# EAGLE design board (EAGLE 9.6.2)
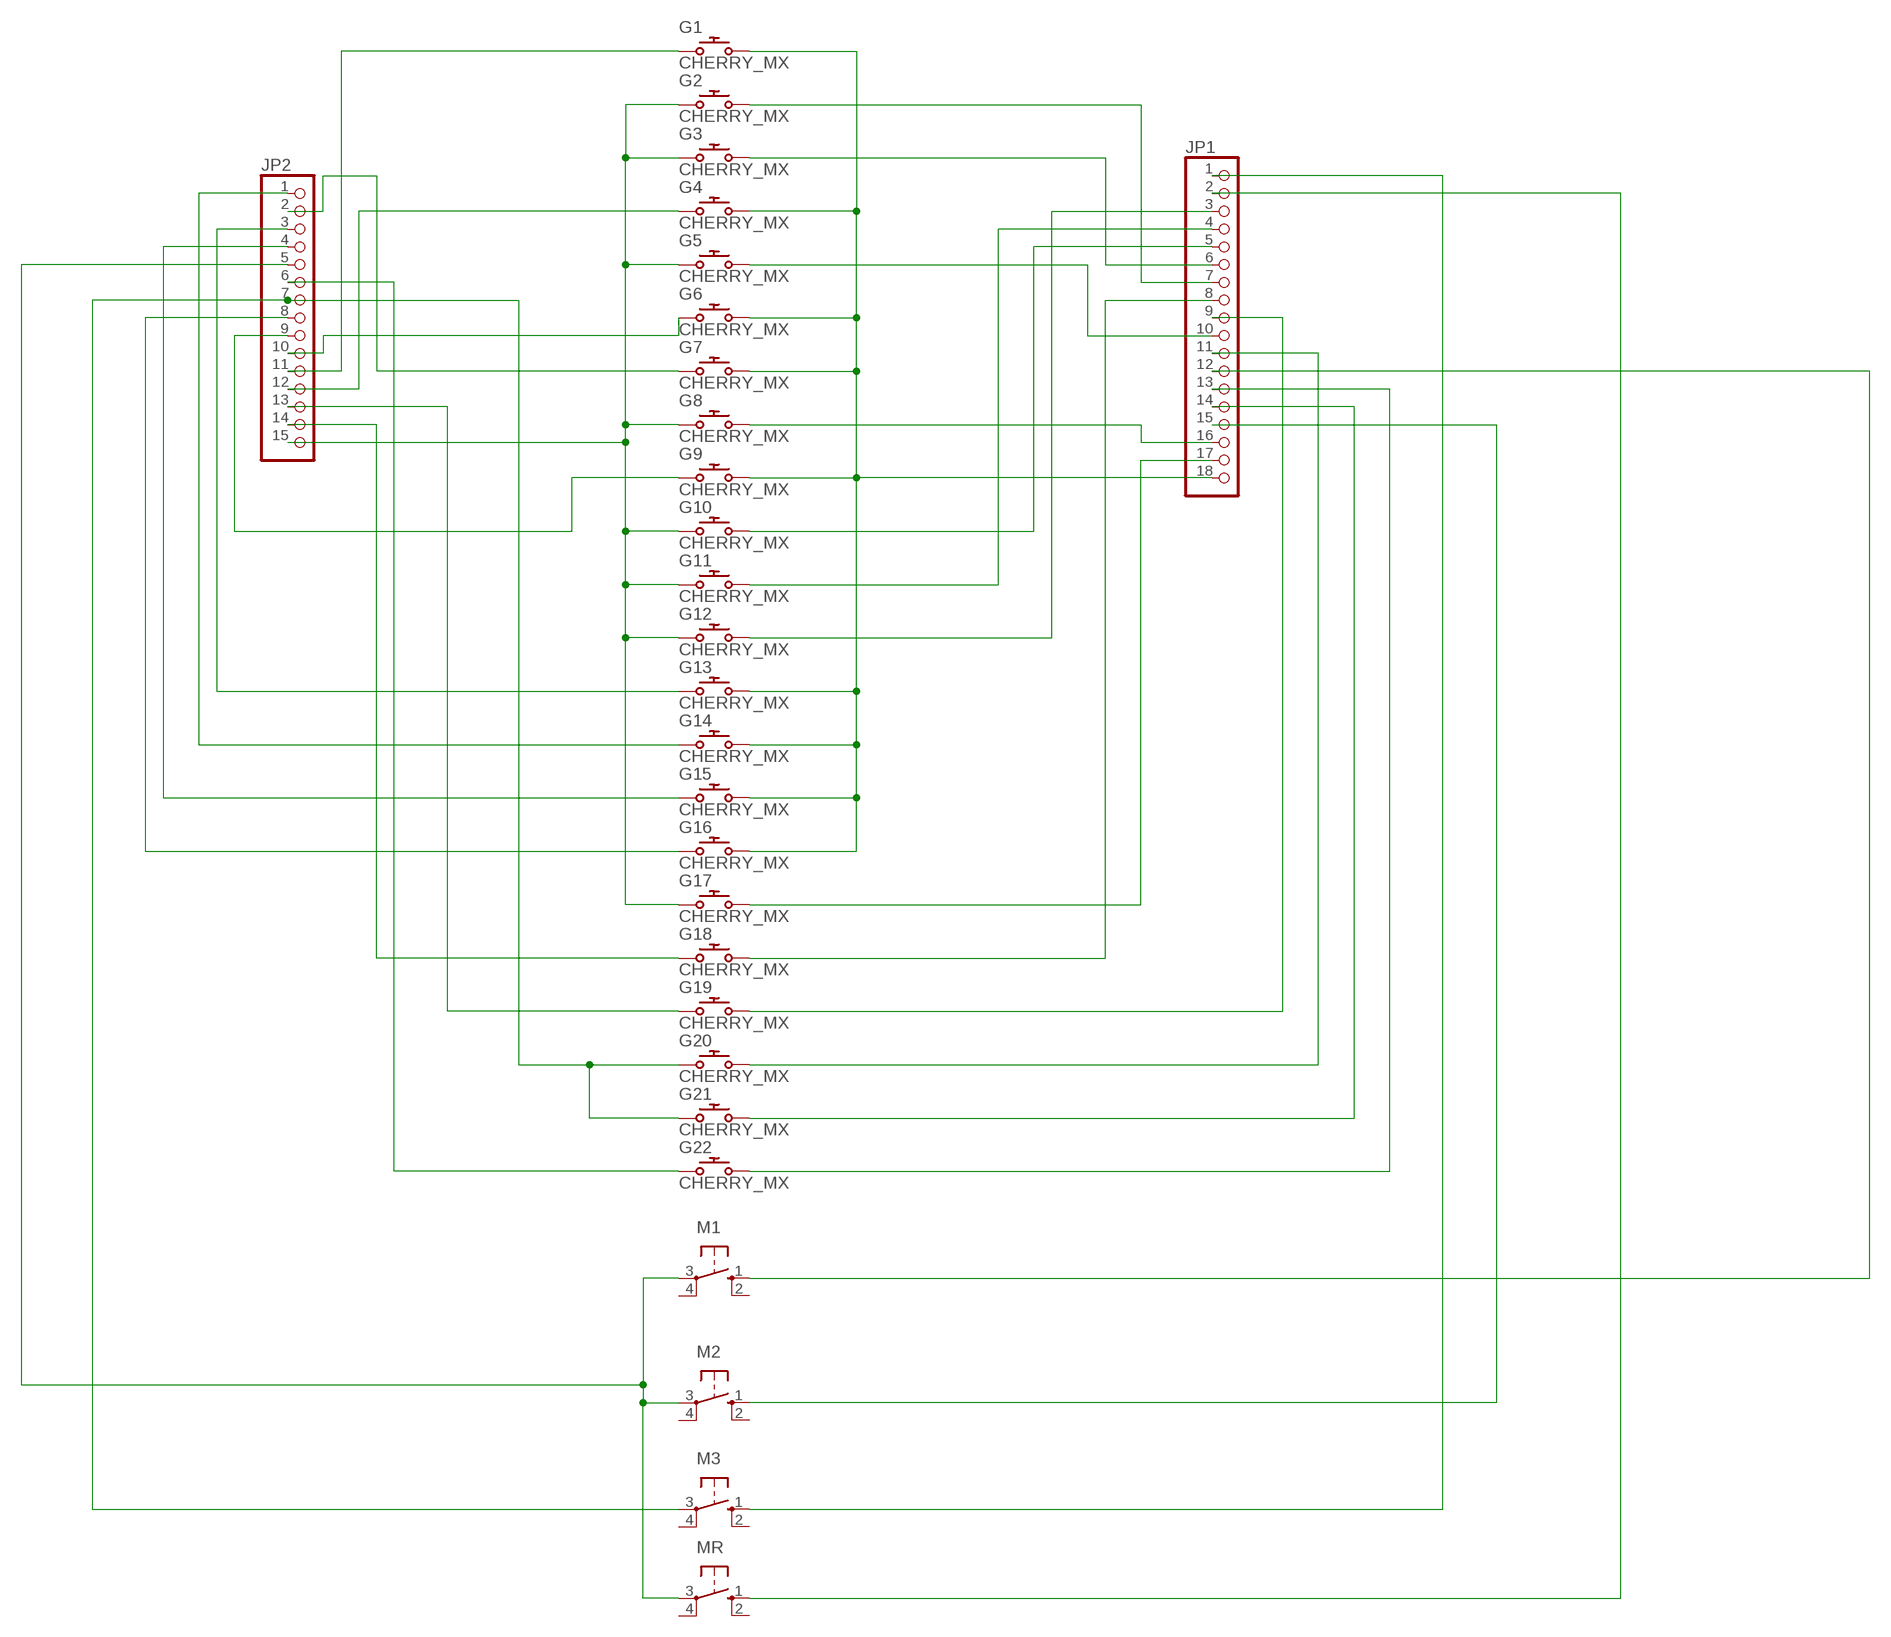
[diagram p0: schematic, sheet 1]

## Parts
G1  CHERRY_MX  [CHERRY_MX]
G2  CHERRY_MX  [CHERRY_MX]
G3  CHERRY_MX  [CHERRY_MX]
G4  CHERRY_MX  [CHERRY_MX]
G5  CHERRY_MX  [CHERRY_MX]
G6  CHERRY_MX  [CHERRY_MX]
G7  CHERRY_MX  [CHERRY_MX]
G8  CHERRY_MX  [CHERRY_MX]
G9  CHERRY_MX  [CHERRY_MX]
G10  CHERRY_MX  [CHERRY_MX]
G11  CHERRY_MX  [CHERRY_MX]
G12  CHERRY_MX  [CHERRY_MX]
G13  CHERRY_MX  [CHERRY_MX]
G14  CHERRY_MX  [CHERRY_MX]
G15  CHERRY_MX  [CHERRY_MX]
G16  CHERRY_MX  [CHERRY_MX]
G17  CHERRY_MX  [CHERRY_MX]
G18  CHERRY_MX  [CHERRY_MX]
G19  CHERRY_MX  [CHERRY_MX]
G20  CHERRY_MX  [CHERRY_MX]
G21  CHERRY_MX  [CHERRY_MX]
G22  CHERRY_MX  [CHERRY_MX]
JP1  PINHD-1X18/90  [1X18/90]
JP2  PINHD-1X15/90  [1X15/90]
M1  10-XX  [B3F-10XX]
M2  10-XX  [B3F-10XX]
M3  10-XX  [B3F-10XX]
MR  10-XX  [B3F-10XX]

## Nets
N$1: G2.S1 G3.S1 G5.S1 G8.S1 G10.S1 G11.S1 G12.S1 G17.S1 JP2.15
N$2: G6.S1 JP2.10
N$3: G1.S1 JP2.11
N$4: G4.S1 JP2.12
N$5: G7.S1 JP2.2
N$6: G13.S1 JP2.3
N$7: G9.S1 JP2.9
N$8: G14.S1 JP2.1
N$9: G15.S1 JP2.4
N$10: G16.S1 JP2.8
N$11: G18.S1 JP2.14
N$12: G19.S1 JP2.13
N$13: G20.S1 G21.S1 JP2.7 M3.3(P)
N$14: G11.S2 JP1.4
N$15: G22.S1 JP2.6
N$16: G1.S2 G4.S2 G6.S2 G7.S2 G9.S2 G13.S2 G14.S2 G15.S2 G16.S2 JP1.18
N$17: G2.S2 JP1.7
N$18: G3.S2 JP1.6
N$19: G5.S2 JP1.10
N$20: G8.S2 JP1.16
N$21: G10.S2 JP1.5
N$22: G12.S2 JP1.3
N$23: G17.S2 JP1.17
N$24: G18.S2 JP1.8
N$25: G19.S2 JP1.9
N$26: G20.S2 JP1.11
N$27: G21.S2 JP1.14
N$28: G22.S2 JP1.13
N$29: JP2.5 M1.3(P) M2.3(P) MR.3(P)
N$31: JP1.1 M3.1(S)
N$32: JP1.2 MR.1(S)
N$33: JP1.15 M2.1(S)
N$34: JP1.12 M1.1(S)
Unconnected: M1.2(S1) M1.4(P1) M2.2(S1) M2.4(P1) M3.2(S1) M3.4(P1) MR.2(S1) MR.4(P1)

## Library data of the parts
G1-G22 = cherry:CHERRY_MX: Cherry keymodule MX; FARNELL: 2292961; MOUSER: 540-MX1A-11NW
JP1 = pinhead:PINHD-1X18: PIN HEADER
JP2 = pinhead:PINHD-1X15: PIN HEADER
M1-M3 MR = switch-omron:10-XX: OMRON SWITCH; MPN: B3F-1000; OC_FARNELL: 176432; OC_NEWARK: 36M3542

## Board
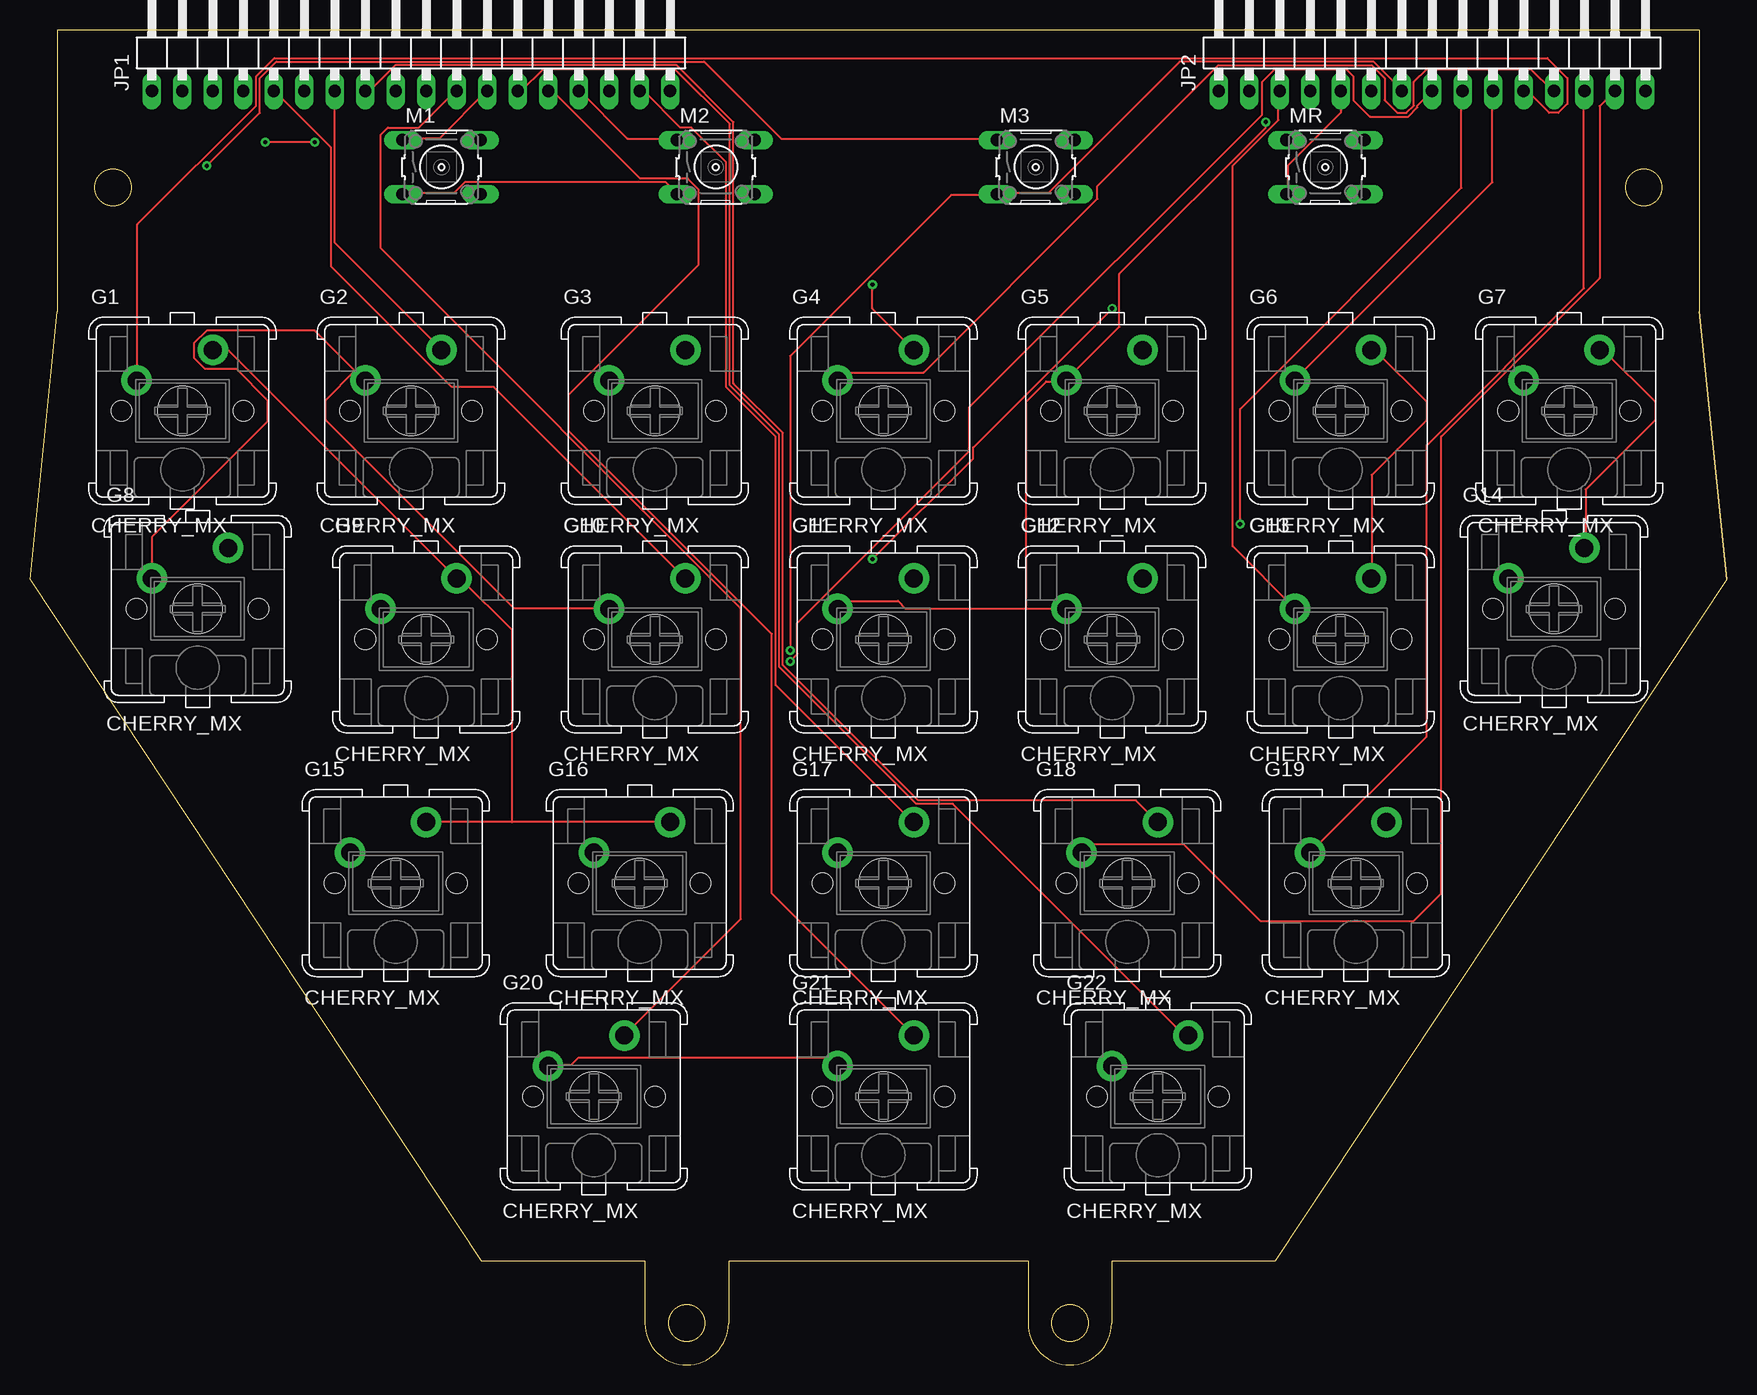
[diagram p1: board, top side]
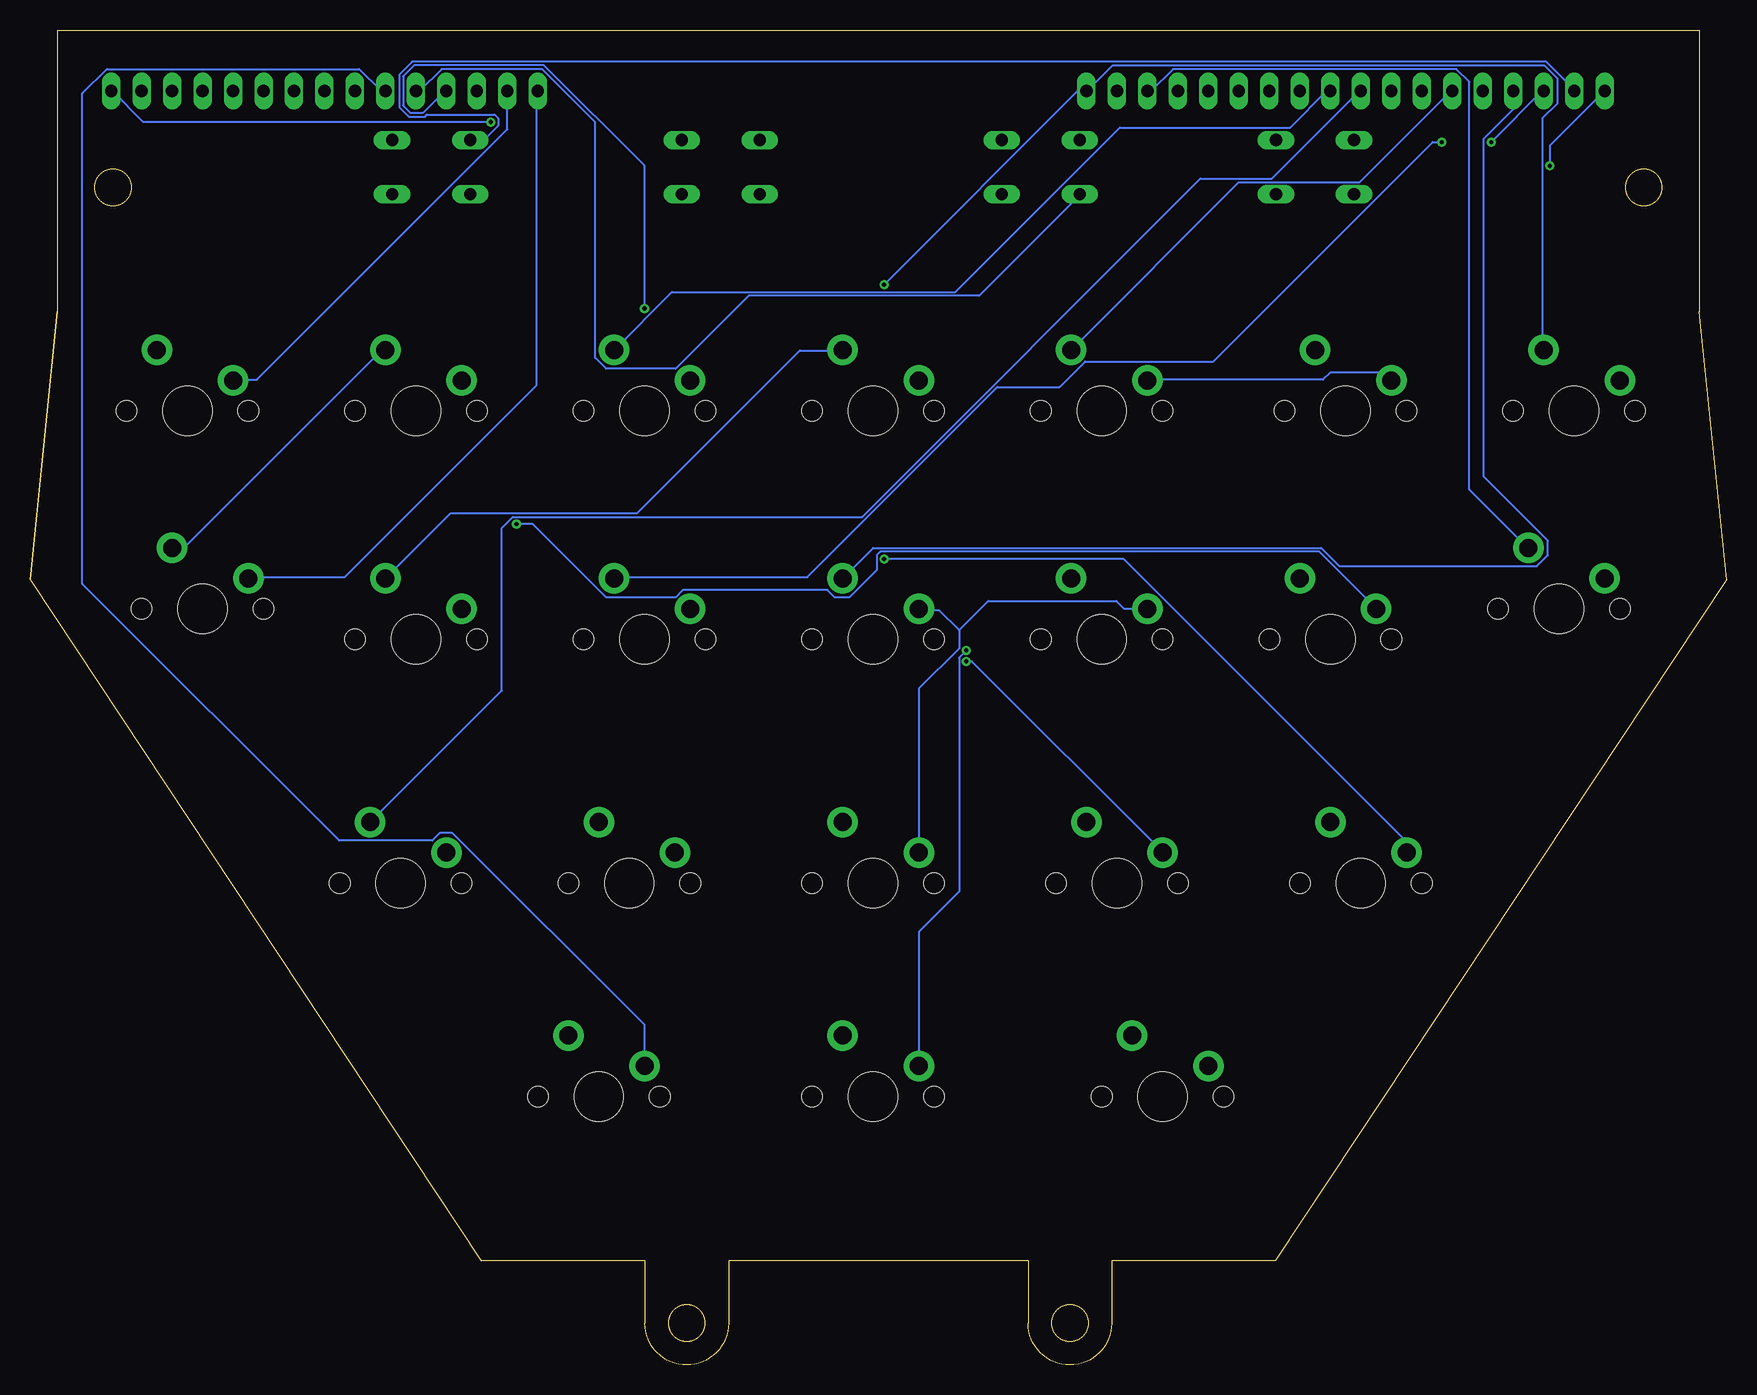
[diagram p2: board, bottom side, seen from below]

Size 141.38 x 111.29 mm. Coordinates in mm from the lower left corner, seen from the top.
Outline: 139.1,87.83 141.38,65.48 103.78,8.67 90.14,8.67 90.14,3.49 arc-180 83.17,3.49 83.17,8.67 58.21,8.67 58.21,3.49 arc-180 51.24,3.49 51.24,8.67 37.6,8.67 0,65.48 2.28,87.83 2.28,111.29 139.1,111.29 139.1,87.83
Outline: 139.1,87.83 141.38,65.5
Outline: circle at 134.48,98.16 radius 1.52
Outline: circle at 6.9,98.16 radius 1.52
Outline: circle at 54.73,3.49 radius 1.52
Outline: circle at 86.65,3.49 radius 1.52
Copper layers (1*16): Top 0.035mm / dielectric 1.5mm / Bottom 0.035mm
Design rules "default": minimum track width 6mil, minimum drill 0.35mm, track to track 6mil, track to pad 6mil, pad to pad 6mil, via to via 6mil, smd to smd 6mil, copper to edge 40mil, drill to drill 6mil, minimum pad ring 10mil, minimum via ring 8mil, stop-mask expansion 4mil, vias tented up to drill 0mil, thermal gap 10mil

### Footprints (pad centres in the part's own frame; a part is rotated, then mirrored left to right if it is on the bottom)
CHERRY_MX = drill 1.5 pad 2.54: S1 -3.81,2.54; S2 2.54,5.08 | hole 1.7: -5.08,0; 5.08,0 | hole 4.1: 0,0
1X18/90 = drill 1.016 long: 1 -21.59,-3.81; 2 -19.05,-3.81; 3 -16.51,-3.81; 4 -13.97,-3.81; 5 -11.43,-3.81; 6 -8.89,-3.81; 7 -6.35,-3.81; 8 -3.81,-3.81; 9 -1.27,-3.81; 10 1.27,-3.81; 11 3.81,-3.81; 12 6.35,-3.81; 13 8.89,-3.81; 14 11.43,-3.81; 15 13.97,-3.81; 16 16.51,-3.81; 17 19.05,-3.81; 18 21.59,-3.81
1X15/90 = drill 1.016 long: 1 -17.78,-3.81; 2 -15.24,-3.81; 3 -12.7,-3.81; 4 -10.16,-3.81; 5 -7.62,-3.81; 6 -5.08,-3.81; 7 -2.54,-3.81; 8 0,-3.81; 9 2.54,-3.81; 10 5.08,-3.81; 11 7.62,-3.81; 12 10.16,-3.81; 13 12.7,-3.81; 14 15.24,-3.81; 15 17.78,-3.81
B3F-10XX = drill 1.016 long: 1 -3.251,2.261; 2 3.251,2.261; 3 -3.251,-2.261; 4 3.251,-2.261

### Placement (x,y rotation side)
G1  12.7,79.54 0 top
G2  31.75,79.54 0 top
G3  52.07,79.54 0 top
G4  71.12,79.54 0 top
G5  90.17,79.54 0 top
G6  109.22,79.54 0 top
G7  128.27,79.54 0 top
G8  13.97,63.03 0 top
G9  33.02,60.49 0 top
G10  52.07,60.49 0 top
G11  71.12,60.49 0 top
G12  90.17,60.49 0 top
G13  109.22,60.49 0 top
G14  127,63.03 0 top
G15  30.48,40.17 0 top
G16  50.8,40.17 0 top
G17  71.12,40.17 0 top
G18  91.44,40.17 0 top
G19  110.49,40.17 0 top
G20  46.99,22.39 0 top
G21  71.12,22.39 0 top
G22  93.98,22.39 0 top
JP1  31.75,110.02 0 top
JP2  116.84,110.02 0 top
M1  34.29,99.86 0 top
M2  57.15,99.86 0 top
M3  83.82,99.86 0 top
MR  107.95,99.86 0 top

### Tracks (layer width: path | path; a pad name or v marks a point on that pad's centre or on a via)
N$1  (via drill 0.35)
  Top 0.152: v102.97,103.62 102.97,103.16 90.78,90.97 90.78,86.55 86.36,82.13 G5.S1 86.36,81.98 84.68,81.98 83.01,80.3 83.01,63.08 | G8.S1 10.16,69.02 19.76,78.63 19.76,80.45 17.17,83.05 14.58,83.05 13.66,83.96 13.66,85.18 14.73,86.25 23.72,86.25 27.08,82.89 | 27.08,82.89 27.84,82.13 G2.S1 27.08,82.89 | 83.01,63.08 72.95,63.08 72.34,63.69 67.92,63.69 67.31,63.08 G11.S1 | 83.01,63.08 86.36,63.08 G12.S1 | 27.08,82.89 24.64,80.45 24.64,78.78 40.34,63.08 48.26,63.08 G10.S1
  Bottom 0.152: v102.97,103.62 131.93,103.62 134.52,106.21 JP2.15 | G2.S1 28.6,82.74 33.02,82.74 33.63,82.13 48.26,82.13 G3.S1 | G17.S1 67.31,56.38 63.96,59.73 63.96,61.25 | 63.96,61.25 65.63,62.93 67.31,62.93 G11.S1 | 63.96,61.25 61.52,63.69 50.85,63.69 50.24,63.08 48.26,63.08 G10.S1
N$2
  Top 0.152: JP2.10 121.87,106.21 121.87,98.59 105.41,82.13 G6.S1
N$3
  Top 0.152: JP2.11 124.77,106.21 126.59,104.38 127.36,104.38 128.12,105.14 128.12,107.28 126.44,108.95 20.37,108.95 18.85,107.43 18.85,104.99 8.94,95.09 8.94,82.13 G1.S1
N$4
  Top 0.152: JP2.12 126.9,106.21 125.07,108.04 116.38,108.04 115.32,106.97 115.32,104.99 114.71,104.38 113.94,104.38 112.88,105.45 112.88,107.28 111.81,108.34 99.01,108.34 88.95,98.29 88.95,97.22 74.47,82.74 67.92,82.74 67.31,82.13 G4.S1
N$5
  Bottom 0.152: JP2.2 101.6,103.01 122.48,82.13 124.46,82.13 G7.S1
N$6
  Top 0.152: JP2.3 104.04,106.21 104.04,103.77 100.23,99.96 100.23,68.26 105.41,63.08 G13.S1
N$7  (via drill 0.35)
  Top 0.152: v100.84,70.09 100.84,79.69 119.28,98.13 119.28,106.21 JP2.9
  Bottom 0.152: v100.84,70.09 99.47,70.09 93.37,64 87.58,64 86.97,64.61 74.93,64.61 74.32,64 73.1,64 70.81,66.28 70.81,67.5 70.51,67.81 33.93,67.81 29.21,63.08 G9.S1
N$8
  Bottom 0.152: JP2.1 99.16,106.21 99.16,81.67 115.16,65.67 123.09,65.67 G14.S1
N$9  (via drill 0.35)
  Top 0.152: v90.17,88.07 78.59,76.49 78.59,75.58 v70.21,67.2
  Bottom 0.152: v90.17,88.07 90.17,99.96 98.55,108.34 109.37,108.34 110.29,107.43 110.29,104.99 109.68,104.38 108.61,104.38 106.78,106.21 JP2.4 | v70.21,67.2 50.24,67.2 26.77,43.73 26.77,42.81 G15.S1
N$10  (via drill 0.35)
  Top 0.152: JP2.8 115.62,104.99 115.62,104.84 114.86,104.08 111.66,104.08 110.29,105.45 110.29,107.43 109.68,108.04 103.73,108.04 102.67,106.97 102.67,104.23 78.28,79.85 78.28,76.19 63.96,61.86 63.96,59.27 v63.35,58.66
  Bottom 0.152: v63.35,58.66 62.89,58.66 47.04,42.81 G16.S1
N$11
  Top 0.152: JP2.14 130.81,104.94 130.81,90.61 117.6,77.41 117.6,39.31 115.32,37.02 102.51,37.02 96.11,43.42 88.34,43.42 G18.S1
N$12
  Top 0.152: G19.S1 116.38,52.41 116.38,76.64 129.49,89.75 129.49,106.21 JP2.13
N$13  (via drill 0.35)
  Top 0.152: G20.S1 43.23,24.98 45.06,24.98 45.67,25.59 66.7,25.59 67.31,24.98 G21.S1 | JP2.7 114.4,106.21 111.96,108.65 95.81,108.65 84.84,97.68 80.57,97.68 M3.3 80.57,97.52 76.76,97.52 63.35,84.11 v63.35,59.58
  Bottom 0.152: G21.S1 67.31,36.11 63.96,39.46 63.96,58.97 v63.35,59.58
N$14
  Bottom 0.152: JP1.4 17.78,104.69 20.22,102.25 20.22,74.05 14.88,68.72 14.88,67.5 15.8,66.59 32.26,66.59 33.78,68.11 71.12,68.11 G11.S2
N$15
  Bottom 0.152: JP2.6 112.12,106.21 113.94,108.04 134.98,108.04 137.01,106.01 137.01,65.11 115.62,43.73 107.85,43.73 107.24,44.34 106.17,44.34 90.17,28.33 G22.S1
N$16  (via drill 0.35)
  Top 0.152: G16.S2 40.18,45.25 | 40.18,45.25 G15.S2 | 40.18,45.25 40.18,61.25 35.92,65.52 35.61,65.52 G9.S2 16.56,84.57 15.34,84.57 G1.S2 | v70.21,90.06 70.21,88.07 G4.S2 | G14.S2 129.64,68.11 129.64,72.99 135.43,78.78 135.43,80.3 131.17,84.57 130.86,84.57 G7.S2 | G13.S2 111.81,65.67 111.81,74.21 116.38,78.78 116.38,80.3 112.12,84.57 111.81,84.57 G6.S2
  Bottom 0.152: v70.21,90.06 54.05,106.21 JP1.18 53.29,106.21 51.16,108.34 15.19,108.34 14.12,107.28 14.12,105.14 15.34,103.92 15.34,84.72 G1.S2 | G14.S2 128.57,68.11 112.12,84.57 111.81,84.57 G6.S2 | G13.S2 106.32,71.01 90.78,71.01 77.22,84.57 73.71,84.57 G4.S2
N$17
  Top 0.152: JP1.7 25.4,93.56 34.24,84.72 G2.S2
N$18
  Bottom 0.152: G3.S2 40.64,98.59 30.58,98.59 22.96,106.21 JP1.6
N$19
  Bottom 0.152: JP1.10 33.33,106.21 36.37,103.16 50.55,103.16 64.26,89.45 87.88,89.45 G5.S2
N$20
  Bottom 0.152: JP1.16 47.95,106.21 46.13,108.04 22.5,108.04 21.44,106.97 21.44,72.99 16.56,68.11 G8.S2
N$21
  Top 0.152: G10.S2 38.66,81.52 35.15,81.52 25.09,91.58 25.09,101.49 20.37,106.21 JP1.5
N$22  (via drill 0.35)
  Top 0.152: v23.72,101.94 v19.61,101.94
  Bottom 0.152: v19.61,101.94 15.34,106.21 JP1.3 | v23.72,101.94 24.49,101.94 42.77,83.66 53.44,83.66 55.58,81.52 60.76,81.52 76.61,65.67 92.61,65.67 G12.S2
N$23
  Top 0.152: JP1.17 51.16,106.21 54.2,103.16 55.12,103.16 58.01,100.27 58.01,81.52 62.13,77.41 62.13,56.68 73.56,45.25 G17.S2
N$24
  Top 0.152: JP1.8 28.3,106.21 30.43,108.34 53.9,108.34 58.62,103.62 58.62,81.83 62.74,77.71 62.74,58.36 74.02,47.08 92.15,47.08 G18.S2
N$25
  Bottom 0.152: G19.S2 102.06,56.22 102.06,69.79 101.14,70.7 72.03,70.7 43.84,98.9 37.9,98.9 30.58,106.21 JP1.9
N$26
  Top 0.152: G20.S2 59.23,37.17 59.23,63.08 29.21,93.1 29.21,102.55 29.82,103.16 32.41,103.16 35.46,106.21 JP1.11
N$27
  Top 0.152: JP1.14 43.54,106.21 50.85,98.9 54.81,98.9 55.73,97.98 55.73,91.73 44.91,80.91 44.91,77.86 61.82,60.95 61.82,39.31 G21.S2
N$28
  Top 0.152: JP1.13 40.95,106.21 42.77,108.04 53.75,108.04 58.32,103.47 58.32,81.67 62.43,77.56 62.43,58.2 73.86,46.77 76.91,46.77 96.11,27.57 96.42,27.57 G22.S2
N$29
  Top 0.152: JP2.5 109.22,104.38 104.8,99.96 104.8,97.68 MR.3 | M1.3 31.04,97.68 35.31,97.68 36.22,98.59 52.98,98.59 53.9,97.68 M2.3
  Bottom 0.152: JP2.5 108.92,106.21 107.09,108.04 98.7,108.04 94.28,103.62 94.28,83.96 93.37,83.05 87.58,83.05 81.48,89.14 62.28,89.14 53.9,97.52 M2.3
N$31  (via drill 0.35)
  Top 0.152: v14.73,99.96 19.15,104.38 19.15,107.28 20.52,108.65 56.19,108.65 62.59,102.25 80.57,102.25 M3.1
  Bottom 0.152: v14.73,99.96 14.73,101.64 JP1.1
N$32
  Bottom 0.152: MR.1 104.65,102.25 103.43,102.25 102.36,103.31 102.36,103.92 102.67,104.23 108.31,104.23 108.46,104.08 109.83,104.08 110.59,104.84 110.59,107.58 109.53,108.65 15.04,108.65 12.6,106.21 JP1.2
N$33
  Top 0.152: M2.1 53.9,102.25 49.78,102.25 45.82,106.21 JP1.15
N$34
  Top 0.152: M1.1 31.04,102.25 34.09,102.25 38.05,106.21 JP1.12